# EAGLE design untitled (EAGLE 7.7.0)
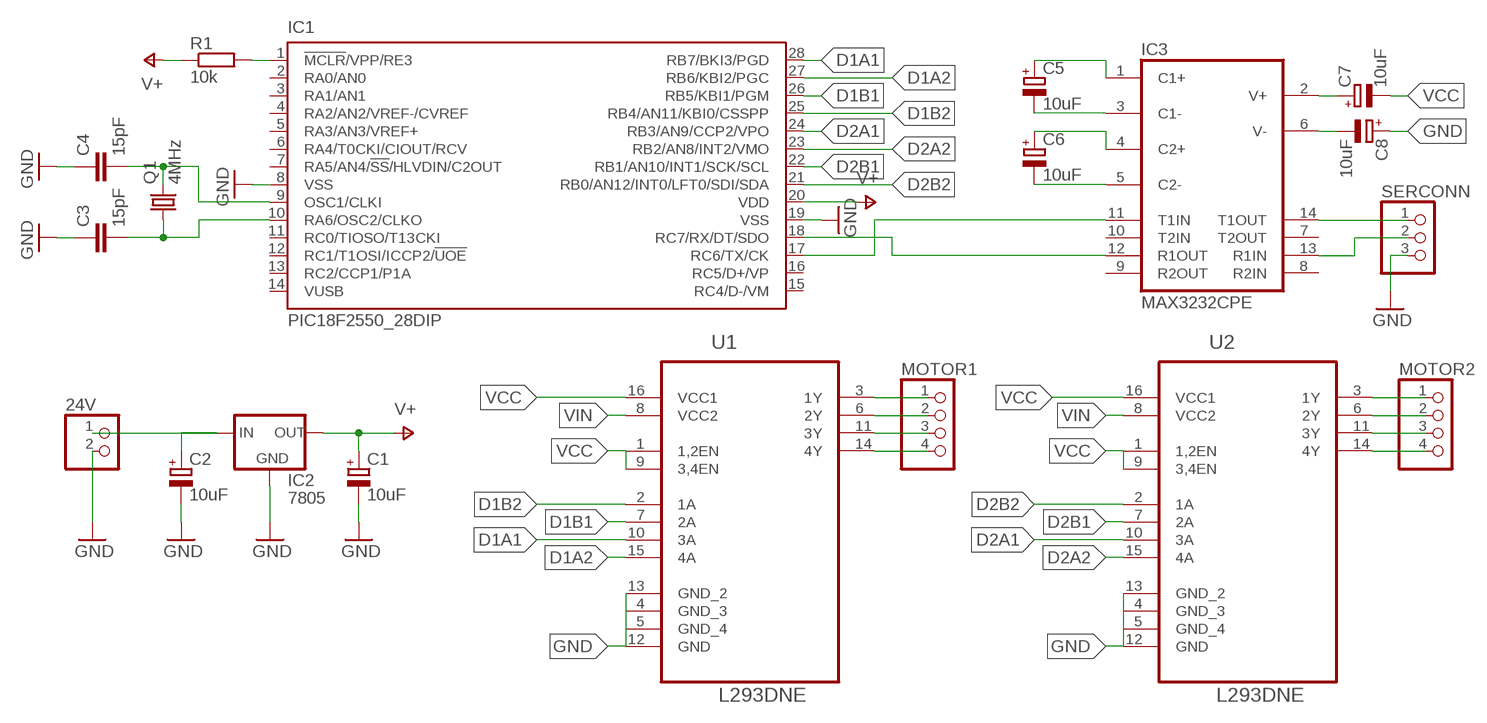
[diagram p0: schematic, sheet 1]

## Parts
24V  PINHD-1X2  [1X02]
C1  10uF  CPOL-EUE2.5-6  [E2,5-6]
C2  10uF  CPOL-EUE2.5-6  [E2,5-6]
C3  15pF  C7.5/6  [C7.5B6]
C4  15pF  C7.5/6  [C7.5B6]
C5  10uF  CPOL-EUE2.5-6  [E2,5-6]
C6  10uF  CPOL-EUE2.5-6  [E2,5-6]
C7  10uF  CPOL-EUE2.5-6  [E2,5-6]
C8  10uF  CPOL-EUE2.5-6  [E2,5-6]
IC1  PIC18F2550_28DIP  [DIL28-3]
IC2  7805  78XXL  [78XXL]
IC3  MAX3232CPE  [DIL16]
MOTOR1  PINHD-1X4  [1X04]
MOTOR2  PINHD-1X4  [1X04]
Q1  4MHz  CRYSTALHC49S  [HC49/S]
R1  10k  R-EU_0309/12  [0309/12]
SERCONN  PINHD-1X3  [1X03]
U1  L293DNE  [DIP254P762X508-16]
U2  L293DNE  [DIP254P762X508-16]

## Nets
D1A1: IC1.28(RB7/BKI3/PGD) U1.10(3A)
D1A2: IC1.27(RB6/KBI2/PGC) U1.15(4A)
D1B1: IC1.26(RB5/KBI1/PGM) U1.7(2A)
D1B2: IC1.25(RB4/AN11/KBI0/CSSPP) U1.2(1A)
D2A1: IC1.24(RB3/AN9/CCP2/VPO) U2.10(3A)
D2A2: IC1.23(RB2/AN8/INT2/VMO) U2.15(4A)
D2B1: IC1.22(RB1/AN10/INT1/SCK/SCL) U2.7(2A)
D2B2: IC1.21(RB0/AN12/INT0/LFT0/SDI/SDA) U2.2(1A)
GND: 24V.2 C1.- C2.- C3.1 C4.1 C8.+ IC1.8(VSS) IC1.19(VSS) IC2.GND SERCONN.3 U1.4(GND_3) U1.5(GND_4) U1.12(GND) U1.13(GND_2) U2.4(GND_3) U2.5(GND_4) U2.12(GND) U2.13(GND_2)
N$1: C4.2 IC1.9(OSC1/CLKI) Q1.2
N$2: C3.2 IC1.10(RA6/OSC2/CLKO) Q1.1
N$3: IC3.14(T1OUT) SERCONN.1
N$4: C7.+ IC3.2(V+)
N$5: C8.- IC3.6(V-)
N$6: C5.- IC3.3(C1-)
N$7: C5.+ IC3.1(C1+)
N$8: C6.- IC3.5(C2-)
N$9: C6.+ IC3.4(C2+)
N$10: IC1.18(RC7/RX/DT/SDO) IC3.12(R1OUT)
N$11: IC1.17(RC6/TX/CK) IC3.11(T1IN)
N$12: MOTOR1.3 U1.11(3Y)
N$13: MOTOR1.4 U1.14(4Y)
N$14: MOTOR1.1 U1.3(1Y)
N$15: IC1.1(!MCLR!/VPP/RE3) R1.2
N$16: IC3.13(R1IN) SERCONN.2
N$20: MOTOR1.2 U1.6(2Y)
N$21: MOTOR2.1 U2.3(1Y)
N$22: MOTOR2.2 U2.6(2Y)
N$23: MOTOR2.3 U2.11(3Y)
N$24: MOTOR2.4 U2.14(4Y)
V+: R1.1
VCC: C1.+ C7.- IC1.20(VDD) IC2.OUT U1.1(1,2EN) U1.9(3,4EN) U1.16(VCC1) U2.1(1,2EN) U2.9(3,4EN) U2.16(VCC1) ; supply symbol labelled V+
VIN: 24V.1 C2.+ IC2.IN U1.8(VCC2) U2.8(VCC2)
Unconnected: IC1.2(RA0/AN0) IC1.3(RA1/AN1) IC1.4(RA2/AN2/VREF-/CVREF) IC1.5(RA3/AN3/VREF+) IC1.6(RA4/T0CKI/CIOUT/RCV) IC1.7(RA5/AN4/!SS!/HLVDIN/C2OUT) IC1.11(RC0/TIOSO/T13CKI) IC1.12(RC1/T1OSI/ICCP2/!UOE) IC1.13(RC2/CCP1/P1A) IC1.14(VUSB) IC1.15(RC4/D-/VM) IC1.16(RC5/D+/VP) IC3.7(T2OUT) IC3.8(R2IN) IC3.9(R2OUT) IC3.10(T2IN)

## Power pins joined to a net without a drawn wire
GND: IC3.15(GND)
VCC: IC3.16(VCC)

## Library data of the parts
24V = pinhead:PINHD-1X2: PIN HEADER
C1 C2 C5-C8 = rcl:CPOL-EU: POLARIZED CAPACITOR, European symbol; MF: RUBYCON; MPN: 100PK10MEFC5X11; OC_FARNELL: 2346533
C3 C4 = capacitor-wima:C: CAPACITOR naming: grid - package width; MF: AVX; MPN: 08051A150JAT2A; OC_FARNELL: 1658873
IC1 = microchip:PIC18F2*_28: USB Microcontrollers with nanoWatt Technology High-Performance, Enhanced Flash, 28/40/44-Pin, Source: http://ww1.microchip.com/downloads/en/devicedoc/39632c.pdf; MF: MICROCHIP; MPN: PIC18F2550-I/SP; OC_FARNELL: 9321250; OC_NEWARK: 80K6054
IC2 = v-reg:78XXL: VOLTAGE REGULATOR; MF: STMICROELECTRONICS; MPN: L7805ACV; OC_FARNELL: 1087086
IC3 = maxim:MAX3232*: True RS-232 Transceivers 3.0V to 5.5V, Low-Power up to 1Mbps, Using Four 0.1µF External Capacitors Source: http://pdfserv.maxim-ic.com/en/ds/MAX3222-MAX3241.pdf; MF: MAXIM; MPN: MAX3232CPE+; OC_FARNELL: 9724494; OC_NEWARK: 68K4626
MOTOR1 MOTOR2 = pinhead:PINHD-1X4: PIN HEADER
Q1 = crystal:CRYSTAL: CRYSTAL; MF: CITIZEN FINETECH MIYOTA; MPN: HC49US4.000MABJ-UB; OC_FARNELL: 1611722; OC_NEWARK: unknown
R1 = rcl:R-EU_: RESISTOR, European symbol; MF: BOURNS; MPN: CR0805-FX-1002ELF; OC_FARNELL: 1612522
SERCONN = pinhead:PINHD-1X3: PIN HEADER
U1 U2 = L293DNE:L293DNE: QUADRUPLE HALF-H DRIVERS; MPN: L293DNE; OC_FARNELL: 1470423; OC_NEWARK: 06F9523; PACKAGE: PDIP-16; SUPPLIER: Texas Instruments

## Net classes
0 default: width 0.813 mm, drill 0.508 mm, clearance 0.711 mm

## Board
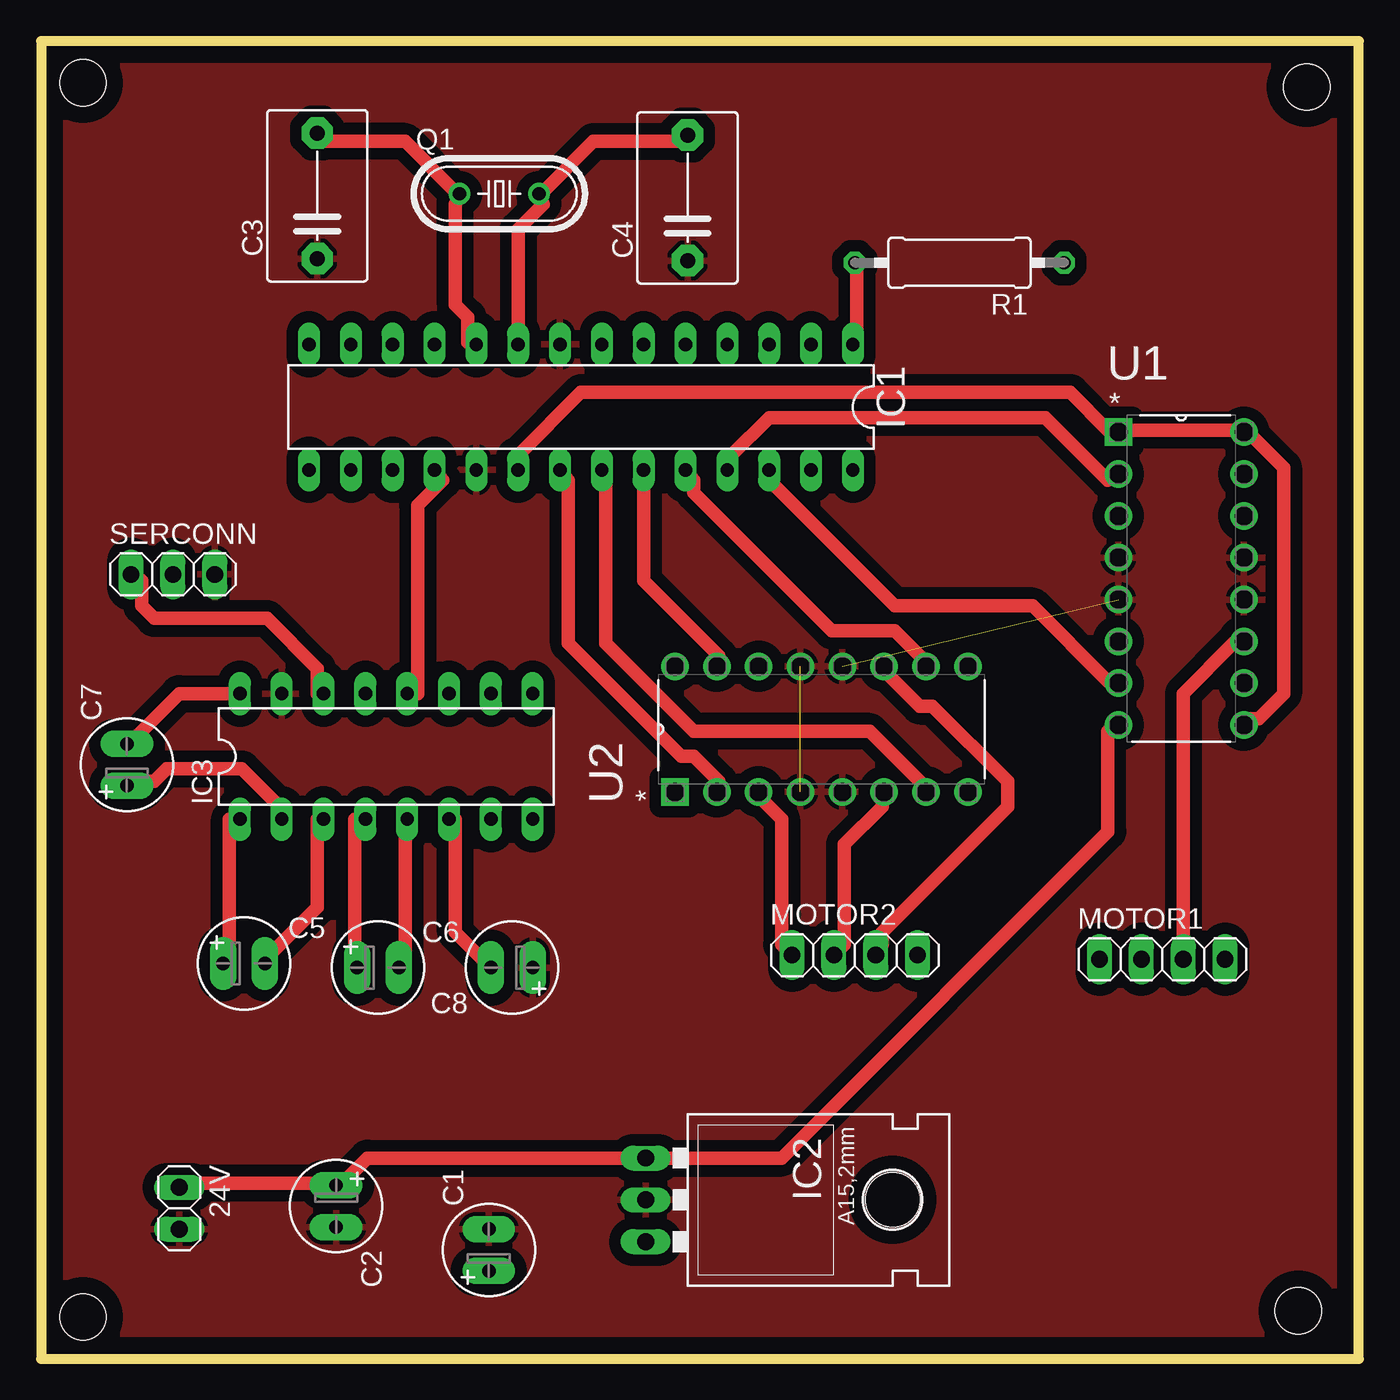
[diagram p1: board, top side]
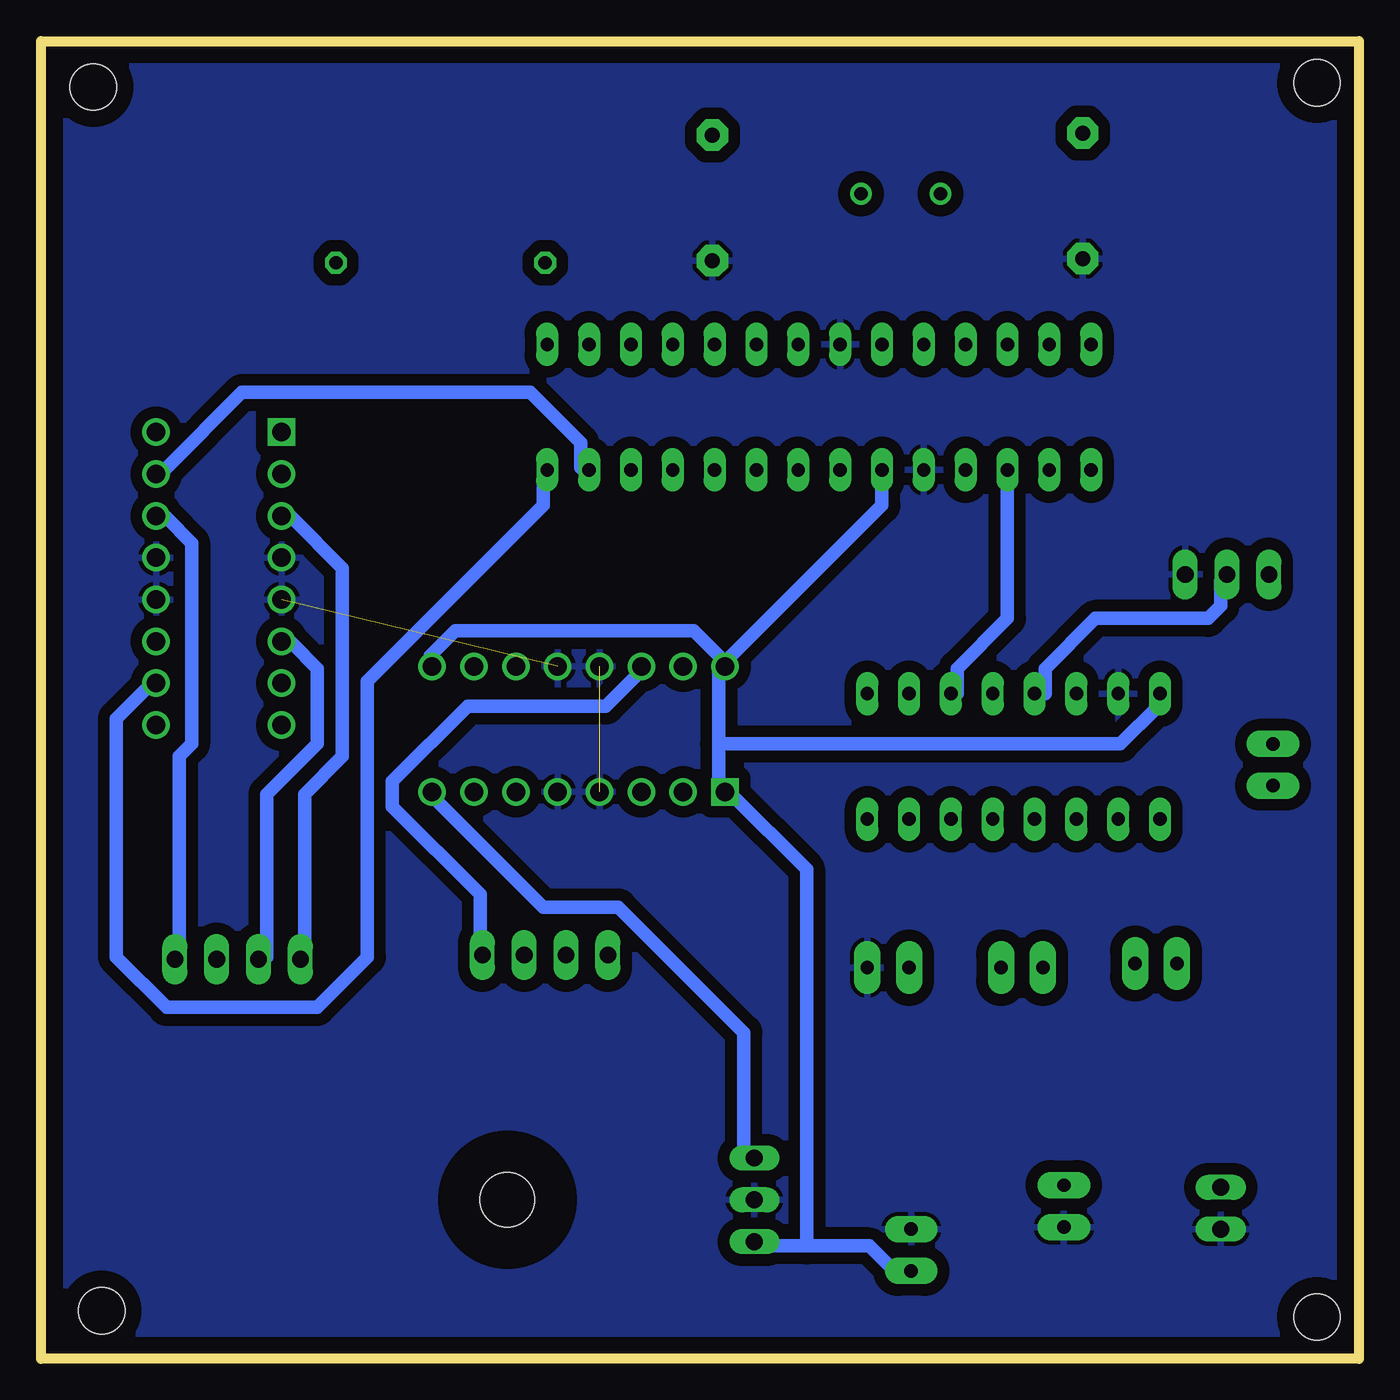
[diagram p2: board, bottom side, seen from below]

Size 80 x 80 mm. Coordinates in mm from the lower left corner, seen from the top.
Outline: 0,0 80,0 80,80 0,80 0,0
Copper layers (1*16): Top 0.035mm / dielectric 1.5mm / Bottom 0.035mm
Design rules "default *": minimum track width 10mil, minimum drill 24mil, track to track 8mil, track to pad 8mil, pad to pad 8mil, via to via 8mil, smd to smd 8mil, copper to edge 40mil, drill to drill 8mil, minimum pad ring 10mil, minimum via ring 8mil, stop-mask expansion 4mil, vias tented up to drill 0mil, thermal gap 10mil
Holes 2.8 mm at 2.54,2.54 76.33,2.92 76.83,77.22 2.54,77.47

### Footprints (pad centres in the part's own frame; a part is rotated, then mirrored left to right if it is on the bottom)
1X02 = drill 1.016 long: 1 -1.27,0; 2 1.27,0
E2,5-6 = drill 0.813 pad 1.6 long: + -1.27,0; - 1.27,0
C7.5B6 = drill 0.914 pad 1.905 octagon: 1 -3.81,0; 2 3.81,0
DIL28-3 = drill 0.813 long: 1 -16.51,-3.81; 2 -13.97,-3.81; 3 -11.43,-3.81; 4 -8.89,-3.81; 5 -6.35,-3.81; 6 -3.81,-3.81; 7 -1.27,-3.81; 8 1.27,-3.81; 9 3.81,-3.81; 10 6.35,-3.81; 11 8.89,-3.81; 12 11.43,-3.81; 13 13.97,-3.81; 14 16.51,-3.81; 15 16.51,3.81; 16 13.97,3.81; 17 11.43,3.81; 18 8.89,3.81; 19 6.35,3.81; 20 3.81,3.81; 21 1.27,3.81; 22 -1.27,3.81; 23 -3.81,3.81; 24 -6.35,3.81; 25 -8.89,3.81; 26 -11.43,3.81; 27 -13.97,3.81; 28 -16.51,3.81
78XXL = drill 1.016 long: GND 0,-3.81; IN -2.54,-3.81; OUT 2.54,-3.81 | hole 3.302: 0,11.176
DIL16 = drill 0.813 long: 1 -8.89,-3.81; 2 -6.35,-3.81; 3 -3.81,-3.81; 4 -1.27,-3.81; 5 1.27,-3.81; 6 3.81,-3.81; 7 6.35,-3.81; 8 8.89,-3.81; 9 8.89,3.81; 10 6.35,3.81; 11 3.81,3.81; 12 1.27,3.81; 13 -1.27,3.81; 14 -3.81,3.81; 15 -6.35,3.81; 16 -8.89,3.81
1X04 = drill 1.016 long: 1 -3.81,0; 2 -1.27,0; 3 1.27,0; 4 3.81,0
HC49/S = drill 0.813: 1 -2.413,0; 2 2.413,0
0309/12 = drill 0.813 octagon: 1 -6.35,0; 2 6.35,0
1X03 = drill 1.016 long: 1 -2.54,0; 2 0,0; 3 2.54,0
DIP254P762X508-16 = drill 1.118 square: 1 -7.62,17.78 | drill 1.118: 2 -7.62,15.24; 3 -7.62,12.7; 4 -7.62,10.16; 5 -7.62,7.62; 6 -7.62,5.08; 7 -7.62,2.54; 8 -7.62,0; 9 0,0; 10 0,2.54; 11 0,5.08; 12 0,7.62; 13 0,10.16; 14 0,12.7; 15 0,15.24; 16 0,17.78

### Placement (x,y rotation side)
24V  8.38,9.14 270 top
C1  27.18,6.6 90 top
C2  17.91,9.27 270 top
C3  16.76,70.61 90 top
C4  39.24,70.48 90 top
C5  12.32,24 0 top
C6  20.45,23.75 0 top
C7  5.21,36.07 90 top
C8  28.57,23.75 180 top
IC1  32.77,57.78 180 top
IC2  40.51,9.65 270 top
IC3  20.95,36.58 0 top
MOTOR1  68.07,24.26 0 top
MOTOR2  49.4,24.51 0 top
Q1  27.81,70.74 0 top
R1  55.75,66.55 180 top
SERCONN  8,47.62 0 top
U1  73.03,38.48 0 top
U2  56.26,42.04 90 top

### Tracks (layer width: path | path; a pad name or v marks a point on that pad's centre or on a via)
D1A1
  Bottom 0.813: IC1.28 49.53,53.34 49.53,51.82 60.2,41.15 60.2,24.38 63.25,21.34 72.39,21.34 75.44,24.38 75.44,38.86 73.15,41.15 U1.10
D1A2
  Bottom 0.813: IC1.27 47.24,54.1 47.24,55.63 50.29,58.67 67.82,58.67 72.39,54.1 U1.15
D1B1
  Top 0.813: IC1.26 44.2,53.34 51.82,45.72 60.2,45.72 64.77,41.15 U1.7
D1B2
  Top 0.813: IC1.25 41.91,54.1 41.91,54.86 44.2,57.15 60.96,57.15 64.77,53.34 U1.2
D2A1
  Top 0.813: IC1.24 39.62,53.34 39.62,52.58 48.01,44.2 51.82,44.2 53.34,42.67 U2.10
D2A2
  Top 0.813: IC1.23 36.58,47.24 41.15,42.67 U2.15
D2B1
  Top 0.813: IC1.22 34.29,53.34 34.29,43.43 39.62,38.1 50.29,38.1 53.34,35.05 U2.7
D2B2
  Top 0.813: IC1.21 32,53.34 32,43.43 38.86,36.58 39.62,36.58 41.15,35.05 U2.2
GND  (2 unrouted)
  pour Bottom: -1.27,81.28 -1.27,-1.27 84.33,-1.4 84.33,81.15
  pour Top: -1.27,80.64 -1.27,-1.27 56.52,-1.27 83.57,-0.76 83.57,80.52
N$1
  Top 0.813: IC1.9 28.96,68.58 30.48,70.1 Q1.2 30.48,70.87 33.53,73.91 38.86,73.91 C4.2
N$2
  Top 0.813: IC1.10 25.91,61.72 25.91,63.25 25.15,64.01 25.15,70.1 Q1.1 25.15,70.87 22.1,73.91 16.76,73.91 C3.2
N$3
  Top 0.813: IC3.14 16.76,40.39 16.76,41.91 13.72,44.96 6.86,44.96 6.1,45.72 6.1,47.24 SERCONN.1
N$4
  Top 0.813: IC3.2 14.48,32.77 14.48,33.53 12.19,35.81 7.62,35.81 6.86,35.05 5.33,35.05 C7.+
N$5
  Top 0.813: C8.- 25.15,25.91 25.15,32.77 IC3.6
N$6
  Top 0.813: IC3.3 16.76,32.77 16.76,27.43 13.72,24.38 C5.-
N$7
  Top 0.813: IC3.1 11.43,32.77 11.43,24.38 C5.+
N$8
  Top 0.813: IC3.5 22.1,32.77 22.1,24.38 C6.-
N$9
  Top 0.813: IC3.4 19.05,32.77 19.05,24.38 C6.+
N$10
  Top 0.813: IC3.12 22.86,40.39 22.86,51.82 24.38,53.34 IC1.18
N$11
  Bottom 0.813: IC1.17 21.34,44.96 24.38,41.91 24.38,40.39 IC3.11
N$12
  Top 0.813: MOTOR1.3 69.34,40.39 72.39,43.43 U1.11
N$13
  Bottom 0.813: MOTOR1.4 71.63,24.38 71.63,36.58 70.87,37.34 70.87,49.53 72.39,51.05 U1.14
N$14
  Bottom 0.813: MOTOR1.1 64.01,24.38 64.01,34.29 61.72,36.58 61.72,48.01 64.77,51.05 U1.3
N$15
  Top 0.813: IC1.1 49.53,61.72 49.53,66.29 R1.2
N$16
  Bottom 0.813: IC3.13 19.05,40.39 19.05,41.91 16,44.96 9.14,44.96 8.38,45.72 8.38,47.24 SERCONN.2
N$20
  Bottom 0.813: MOTOR1.2 66.29,24.38 66.29,34.29 63.25,37.34 63.25,41.91 64.77,43.43 U1.6
N$21
  Top 0.813: MOTOR2.1 44.96,25.15 44.96,32.77 43.43,34.29 U2.3
N$22
  Top 0.813: MOTOR2.2 48.77,25.15 48.77,31.24 51.05,33.53 51.05,34.29 U2.6
N$23
  Top 0.813: MOTOR2.3 51.05,25.15 51.05,25.91 58.67,33.53 58.67,35.05 54.1,39.62 53.34,39.62 51.05,41.91 U2.11
N$24
  Bottom 0.813: MOTOR2.4 53.34,25.15 53.34,28.19 58.67,33.53 58.67,35.05 54.1,39.62 45.72,39.62 43.43,41.91 U2.14
VCC
  Top 0.813: U1.9 73.15,38.86 73.91,38.86 75.44,40.39 75.44,54.1 73.15,56.39 U1.16 72.39,56.39 65.53,56.39 U1.1 64.77,56.39 62.48,58.67 32.77,58.67 28.96,54.86 IC1.20 | IC3.16 8.38,40.39 5.33,37.34 C7.-
  Bottom 0.813: 33.53,6.86 29.72,6.86 28.19,5.33 C1.+ | 33.53,6.86 36.58,6.86 IC2.OUT | IC1.20 28.96,51.82 38.1,42.67 U2.16 | 38.86,37.34 38.86,41.91 U2.16 | 38.86,37.34 38.86,35.05 U2.1 38.1,34.29 33.53,29.72 33.53,6.86 | U2.9 56.39,42.67 54.86,44.2 40.39,44.2 38.86,42.67 U2.16 | 38.86,37.34 14.48,37.34 12.19,39.62 12.19,40.39 IC3.16
VIN
  Top 0.813: 24V.1 8.38,10.67 17.53,10.67 C2.+ 18.29,10.67 19.81,12.19 IC2.IN 44.96,12.19 64.77,32 64.77,38.1 U1.8
  Bottom 0.813: U2.8 56.39,34.29 49.53,27.43 44.96,27.43 37.34,19.81 37.34,12.19 IC2.IN